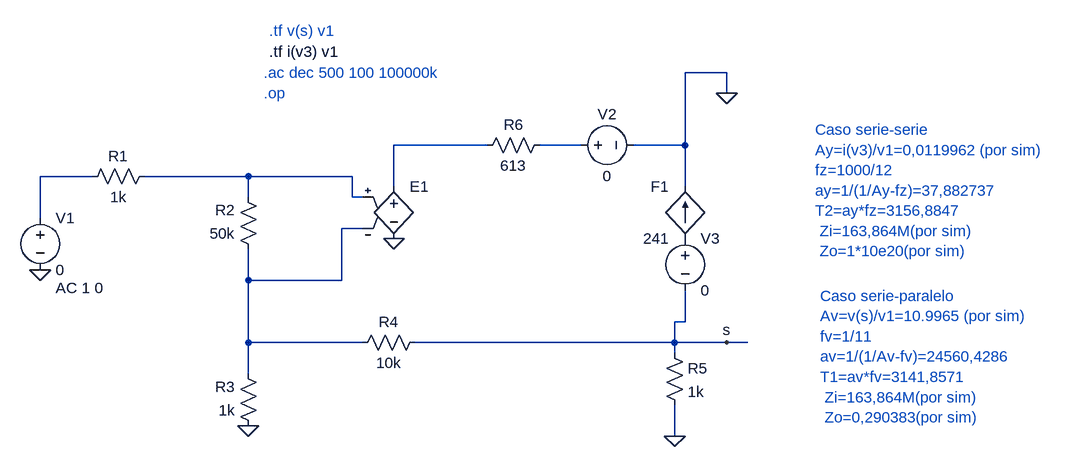
[diagram p0: schematic real_T2.asc]
real_T2.asc, the LTspice schematic file:
Version 4
SHEET 1 1376 1092
WIRE 752 -32 688 -32
WIRE 752 0 752 -32
WIRE 384 80 240 80
WIRE 528 80 464 80
WIRE 688 80 688 -32
WIRE 688 80 608 80
WIRE -224 128 -304 128
WIRE 16 128 -144 128
WIRE 176 128 16 128
WIRE 240 144 240 80
WIRE 688 144 688 80
WIRE 16 160 16 128
WIRE 176 160 176 128
WIRE 192 160 176 160
WIRE -304 192 -304 128
WIRE 192 208 160 208
WIRE 16 288 16 240
WIRE 160 288 160 208
WIRE 160 288 16 288
WIRE 688 352 688 304
WIRE 688 352 672 352
WIRE 16 384 16 288
WIRE 192 384 16 384
WIRE 672 384 672 352
WIRE 672 384 272 384
WIRE 752 384 672 384
WIRE 784 384 752 384
WIRE 672 400 672 384
WIRE 16 432 16 384
WIRE 672 528 672 480
FLAG 240 224 0
FLAG -304 272 0
FLAG 16 512 0
FLAG 672 528 0
FLAG 752 0 0
FLAG 752 384 s
SYMBOL e 240 128 R0
WINDOW 3 24 96 Invisible 2
SYMATTR Value -100/(1+s/62831.8)
SYMATTR InstName E1
SYMATTR SpiceModel laplace
SYMBOL voltage -304 176 R0
WINDOW 123 24 124 Left 2
WINDOW 39 0 0 Left 0
SYMATTR Value2 AC 1 0
SYMATTR InstName V1
SYMATTR Value 0
SYMBOL res -128 112 R90
WINDOW 0 0 56 VBottom 2
WINDOW 3 32 56 VTop 2
SYMATTR InstName R1
SYMATTR Value 1k
SYMBOL res 32 256 R180
WINDOW 0 36 76 Left 2
WINDOW 3 36 40 Left 2
SYMATTR InstName R2
SYMATTR Value 50k
SYMBOL res 32 528 R180
WINDOW 0 36 76 Left 2
WINDOW 3 36 40 Left 2
SYMATTR InstName R3
SYMATTR Value 1k
SYMBOL res 176 400 R270
WINDOW 0 32 56 VTop 2
WINDOW 3 0 56 VBottom 2
SYMATTR InstName R4
SYMATTR Value 10k
SYMBOL res 656 384 R0
SYMATTR InstName R5
SYMATTR Value 1k
SYMBOL res 480 64 R90
WINDOW 0 0 56 VBottom 2
WINDOW 3 32 56 VTop 2
SYMATTR InstName R6
SYMATTR Value 613
SYMBOL voltage 512 80 R270
WINDOW 0 32 56 VTop 2
WINDOW 3 -32 56 VBottom 2
WINDOW 123 0 0 Left 0
WINDOW 39 0 0 Left 0
SYMATTR InstName V2
SYMATTR Value 0
SYMBOL f 688 224 R180
WINDOW 0 24 80 Left 2
WINDOW 3 24 0 Left 2
SYMATTR InstName F1
SYMATTR Value 241
SYMATTR SpiceModel v2
SYMBOL voltage 688 208 R0
WINDOW 123 0 0 Left 0
WINDOW 39 0 0 Left 0
SYMATTR InstName V3
SYMATTR Value 0
TEXT 40 0 Left 2 ;.op
TEXT 40 -32 Left 2 ;.ac dec 500 100 100000k
TEXT 48 -64 Left 2 !.tf i(v3) v1
TEXT 48 -96 Left 2 ;.tf v(s) v1
TEXT 896 312 Left 2 ;Caso serie-paralelo\nAv=v(s)/v1=10.9965 (por sim)\nfv=1/11\nav=1/(1/Av-fv)=24560,4286\nT1=av*fv=3141,8571 \n Zi=163,864M(por sim)  \n Zo=0,290383(por sim)
TEXT 888 56 Left 2 ;Caso serie-serie\nAy=i(v3)/v1=0,0119962 (por sim)\nfz=1000/12\nay=1/(1/Ay-fz)=37,882737\nT2=ay*fz=3156,8847 \n Zi=163,864M(por sim)  \n Zo=1*10e20(por sim)

The netlist it stands for:
* real_T2.asc
E1 N001 0 N004 N005 laplace -100/(1+s/62831.8)
V1 N003 0 0 AC 1 0
R1 N004 N003 1k
R2 N005 N004 50k
R3 0 N005 1k
R4 N005 s 10k
R5 s 0 1k
R6 N002 N001 613
V2 N002 0 0
F1 P001 0 v2 241
V3 P001 s 0
* .op
* .ac dec 500 100 100000k
.tf i(v3) v1
* .tf v(s) v1
* Caso serie-paralelo
* Av=v(s)/v1=10.9965 (por sim)
* fv=1/11
* av=1/(1/Av-fv)=24560,4286
* T1=av*fv=3141,8571
*  Zi=163,864M(por sim)
*  Zo=0,290383(por sim)
* Caso serie-serie
* Ay=i(v3)/v1=0,0119962 (por sim)
* fz=1000/12
* ay=1/(1/Ay-fz)=37,882737
* T2=ay*fz=3156,8847
*  Zi=163,864M(por sim)
*  Zo=1*10e20(por sim)
.backanno
.end